# EAGLE design TinyIRCam-breakout-mk-2.0 (EAGLE 7.5.0)
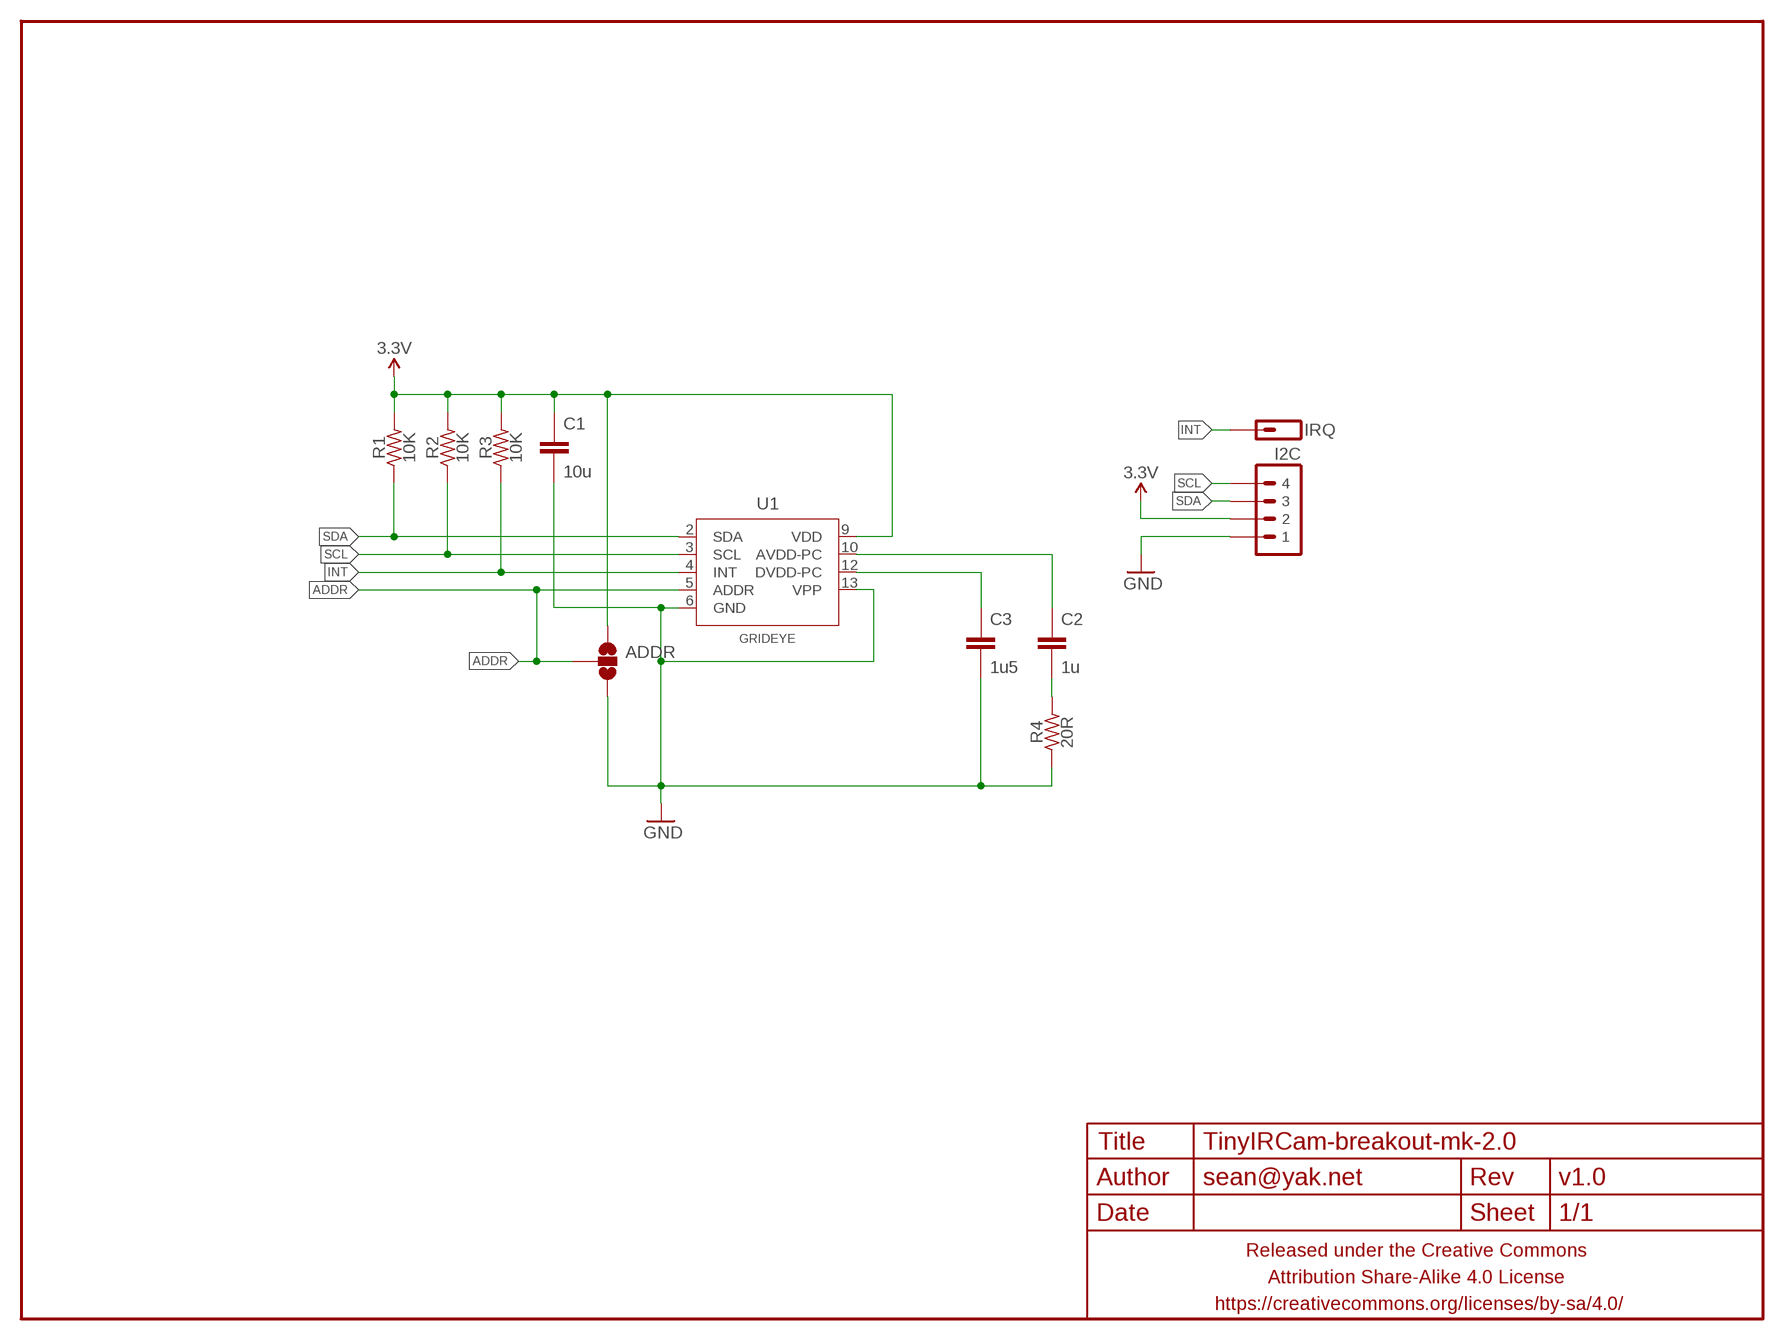
[diagram p0: schematic, sheet 1]

## Parts
ADDR  JUMPER-PAD-3-NOSMALLER  [PAD-JUMPER-3-NO_YES_SILK_FULL_BOX_SMALLER]
C1  10u  CAPACITOR-CERAMICC0603-TIGHTER  [C0603-TIGHTER]
C2  1u  CAPACITOR-CERAMICC0603-TIGHTER  [C0603-TIGHTER]
C3  1u5  CAPACITOR-CERAMICC0603-TIGHTER  [C0603-TIGHTER]
FRAME1  FRAME-LETTERNO_PACKAGE  [DUMMY]
I2C  M04PTH-CENTERED  [1X04-PTH-VERT-CENTER]
IRQ  M01PTH  [1X01]
R1  10K  RESISTORR0603-TIGHTER  [R0603-TIGHTER]
R2  10K  RESISTORR0603-TIGHTER  [R0603-TIGHTER]
R3  10K  RESISTORR0603-TIGHTER  [R0603-TIGHTER]
R4  20R  RESISTORR0603-TIGHTER  [R0603-TIGHTER]
U1  GRIDEYE  GRIDEYEFATTER  [GRIDEYE-FATTER]

## Nets
3.3V: ADDR.1 C1.1 I2C.2 R1.2 R2.2 R3.2 U1.9(VDD)
ADDR: ADDR.2 U1.5(ADDR)
GND: ADDR.3 C1.2 C3.2 I2C.1 R4.1 U1.6(GND) U1.13(VPP)
INT: IRQ.1 R3.1 U1.4(INT)
N$1: C2.2 R4.2
N$2: C3.1 U1.12(DVDD-PC)
N$3: C2.1 U1.10(AVDD-PC)
SCL: I2C.4 R2.1 U1.3(SCL)
SDA: I2C.3 R1.1 U1.2(SDA)

## Library data of the parts
ADDR = a_parts:JUMPER-PAD-3-NO
C1-C3 = a_parts:CAPACITOR-CERAMIC: CAPACITOR, European symbol
FRAME1 = a_parts:FRAME-LETTER: Schematic Frame Standard 8.5x11 US Letter frame; DESIGNER: sean@yak.net; VERSION: v1.0
I2C = a_parts:M04: Header 4 Standard 4-pin 0.1" header. Use with straight break away headers (SKU : PRT-00116), right angle break away headers (PRT-00553), swiss pins (PRT-00743), machine pins (PRT-00117), and female headers (PRT-00115). Molex polarized connector foot print use with SKU : PRT-08231 with associated crimp pins and housings. 1MM SMD Version SKU: PRT-10208
IRQ = a_parts:M01: Header 1 Standard 1-pin 0.1" header. Use with straight break away headers (SKU : PRT-00116), right angle break away headers (PRT-00553), swiss pins (PRT-00743), machine pins (PRT-00117), and female headers (PRT-00115).
R1-R4 = a_parts:RESISTOR: RESISTOR, American symbol
U1 = a_parts:GRIDEYE

## Board
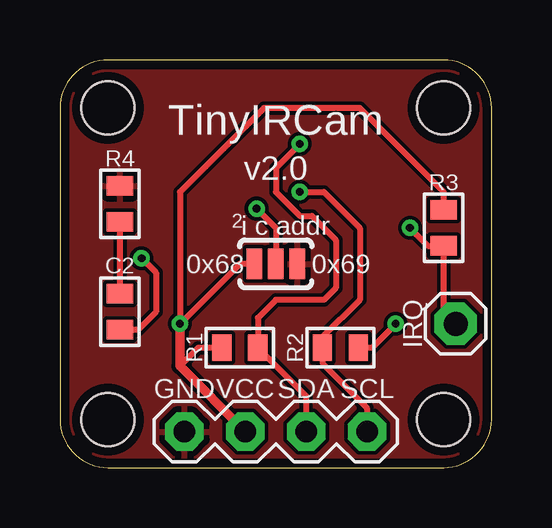
[diagram p1: board, top side]
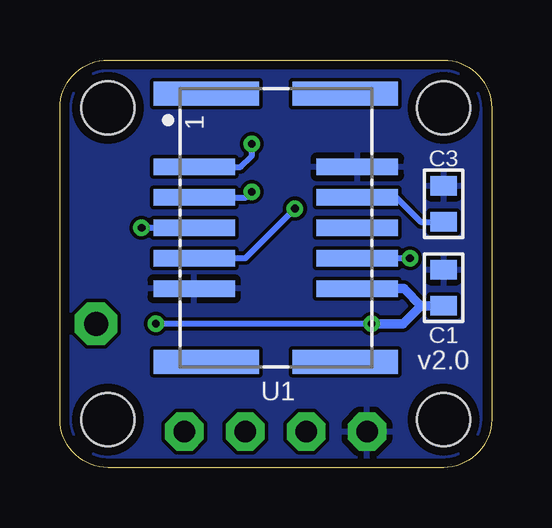
[diagram p2: board, bottom side, seen from below]

Size 18 x 17 mm. Coordinates in mm from the lower left corner, seen from the top.
Outline: 0,15 0,2 arc90 2,0 16,0 arc90 18,2 18,15 arc90 16,17 2,17 arc90 0,15
Copper layers (1*16): Top 0.0356mm / dielectric 1.5011mm / Bottom 0.0356mm
Design rules "LaenPCBOrder2": minimum track width 6mil, minimum drill 13mil, track to track 6mil, track to pad 6mil, pad to pad 6mil, via to via 6mil, smd to smd 6mil, copper to edge 15mil, drill to drill 6mil, minimum pad ring 7mil, minimum via ring 7mil, stop-mask expansion 3mil, vias tented up to drill 20mil, thermal gap 10mil
Holes 2.2 mm at 2,2 2,15 16,2 16,15

### Footprints (pad centres in the part's own frame; a part is rotated, then mirrored left to right if it is on the bottom)
PAD-JUMPER-3-NO_YES_SILK_FULL_BOX_SMALLER = smd 0.635 x 1.27: 1 -0.9,0; 2 0,0; 3 0.9,0
C0603-TIGHTER = smd 0.8 x 1.1: 1 -0.75,0; 2 0.75,0
1X04-PTH-VERT-CENTER = drill 0.9 pad 1.6 octagon: 1 -3.81,0; 2 -1.27,0; 3 1.27,0; 4 3.81,0
1X01 = drill 1 pad 1.778 octagon: 1 0,0
R0603-TIGHTER = smd 0.8 x 1.1: 1 -0.75,0; 2 0.75,0
GRIDEYE-FATTER = smd 1 x 4.4: 1 -5.6,-2.9; 7 5.6,-2.9; 8 5.6,2.9; 14 -5.6,2.9 | smd 0.7 x 3.4: 2 -2.54,-3.4; 3 -1.27,-3.4; 4 0,-3.4; 5 1.27,-3.4; 6 2.54,-3.4; 9 2.54,3.4; 10 1.27,3.4; 11 0,3.4; 12 -1.27,3.4; 13 -2.54,3.4

### Placement (x,y rotation side)
ADDR  9,8.5 0 top
C1  2,7.5 90 bottom
C2  2.5,6.5 90 top
C3  2,11 90 bottom
FRAME1  0,0 0 top
I2C  9,1.5 0 top
IRQ  16.5,6 90 top
R1  7.5,5 180 top
R2  11.7,5 0 top
R3  16,10 90 top
R4  2.5,11 270 top
U1  9,10 270 bottom

### Tracks (layer width: path | path; a pad name or v marks a point on that pad's centre or on a via)
3.3V  (via drill 0.33)
  Top 0.25: ADDR.1 7.5,8.5 v5,6 5,11.5 8.5,15 12.5,15 16,11.5 R3.2 | v14,6 13,5 R2.2 | R1.2 5.77,5 5,4.23
  Top 0.4: v5,6 5,4.23 I2C.2
  Bottom 0.25: v5,6 v14,6
  Bottom 0.4: U1.9 3.66,7.46 2.95,6.75 | 2.95,6.75 C1.1 | 2.95,6.75 3.7,6 v5,6
ADDR  (via drill 0.33)
  Top 0.25: v8.2,10.8 9,10 ADDR.2
  Bottom 0.25: U1.5 10.27,8.73 v8.2,10.8
GND
  pour Bottom (rank 6): 0,15 0,2 arc90 2,0 16,0 arc90 18,2 18,15 arc90 16,17 2,17 arc90
  pour Top (rank 6): 18,15 18,2 arc-90 16,0 2,0 arc-90 0,2 0,15 arc-90 2,17 16,17 arc-90
INT  (via drill 0.33)
  Top 0.25: v14.6,10 15.35,9.25 R3.1 16,6.5 IRQ.1
  Bottom 0.25: U1.4 v14.6,10
N$1
  Top 0.25: C2.2 R4.2
N$2
  Bottom 0.25: U1.12 3.97,11.27 2.95,10.25 C3.1
N$3  (via drill 0.33)
  Top 0.25: v3.4,8.73 4,8.13 4,6.5 3.25,5.75 C2.1
  Bottom 0.25: U1.10 v3.4,8.73
SCL  (via drill 0.33)
  Top 0.25: v10,11.5 11,11.5 12.5,10 12.5,7 10.95,5.45 R2.1 10.95,4.35 12.8,2.5 I2C.4
  Bottom 0.25: U1.3 10.23,11.27 v10,11.5
SDA  (via drill 0.33)
  Top 0.25: v10,13.5 9,12.5 9,11.5 10,10.5 10.5,10.5 11.5,9.5 11.5,7.5 11,7 9,7 8.25,6.25 R1.1 10.27,2.98 I2C.3
  Bottom 0.25: U1.2 10.46,12.54 10,13 v10,13.5

### Text on the board
tPlace: TinyIRCam | 2 | i c addr | 0x68 | 0x69 | GND | VCC | SDA | SCL